# Altium schematic sheet STM32_SBM_v2.SchDoc
size A1
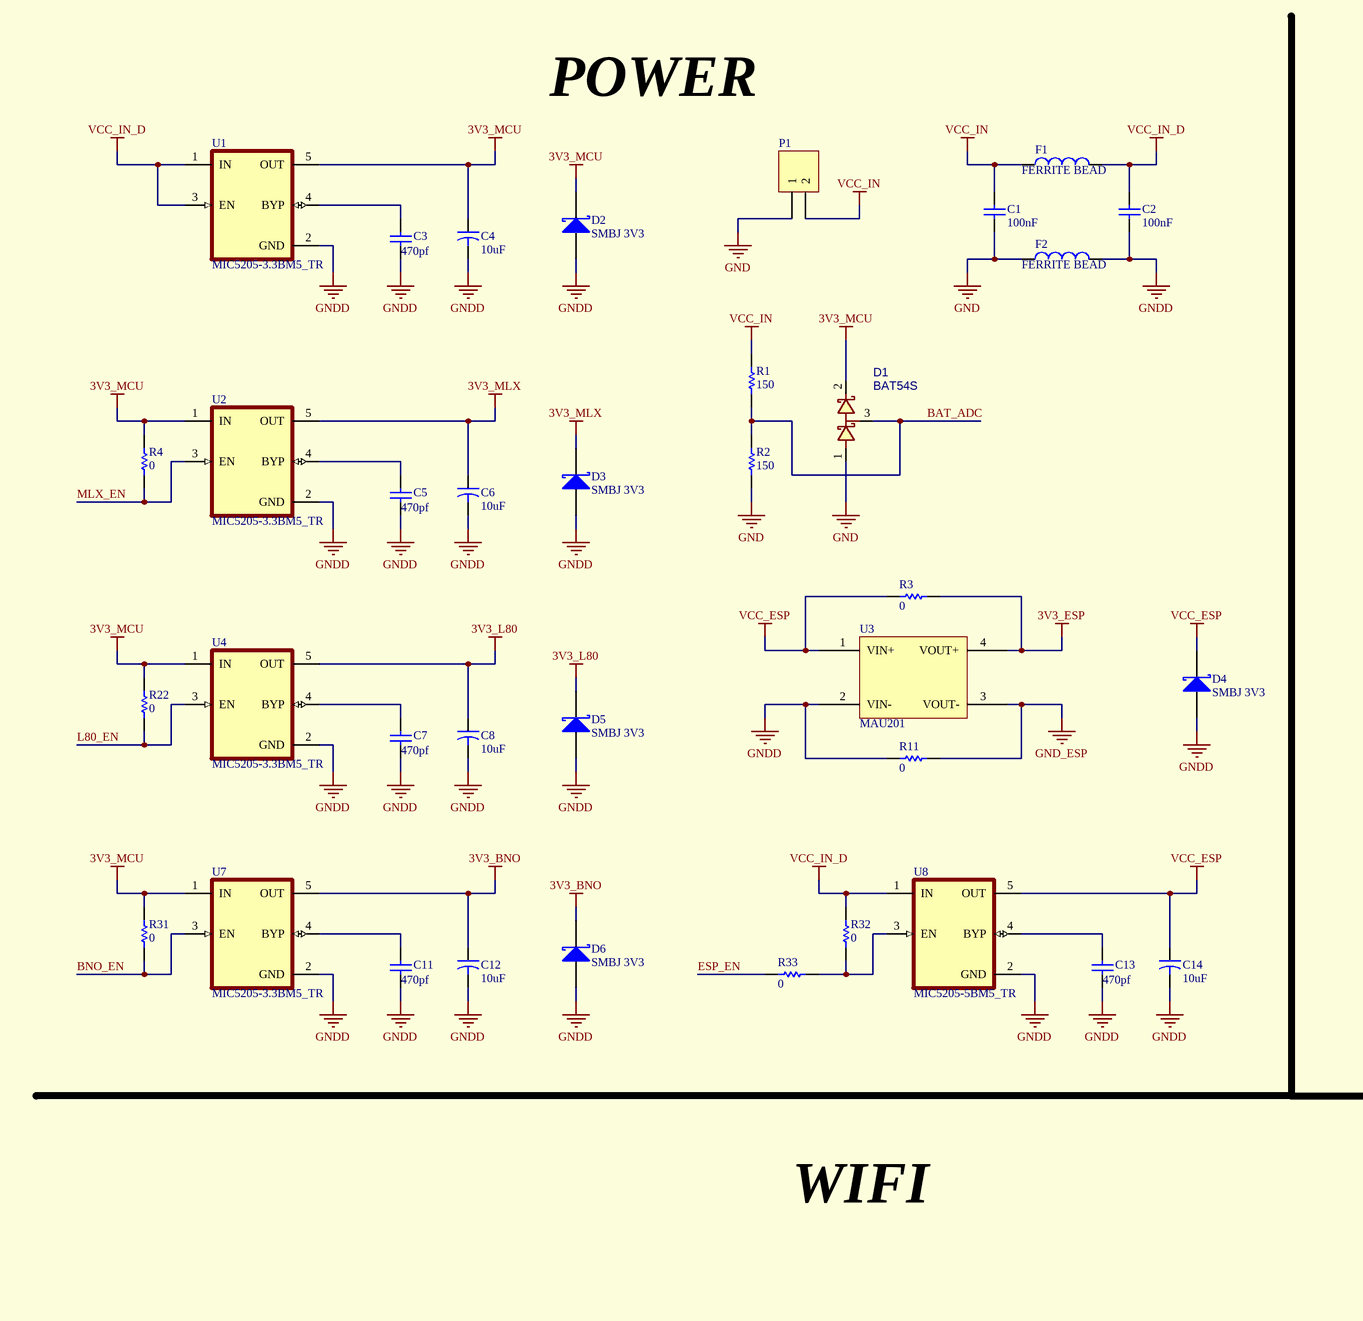
[diagram p0: STM32_SBM_v2.SchDoc, top left]
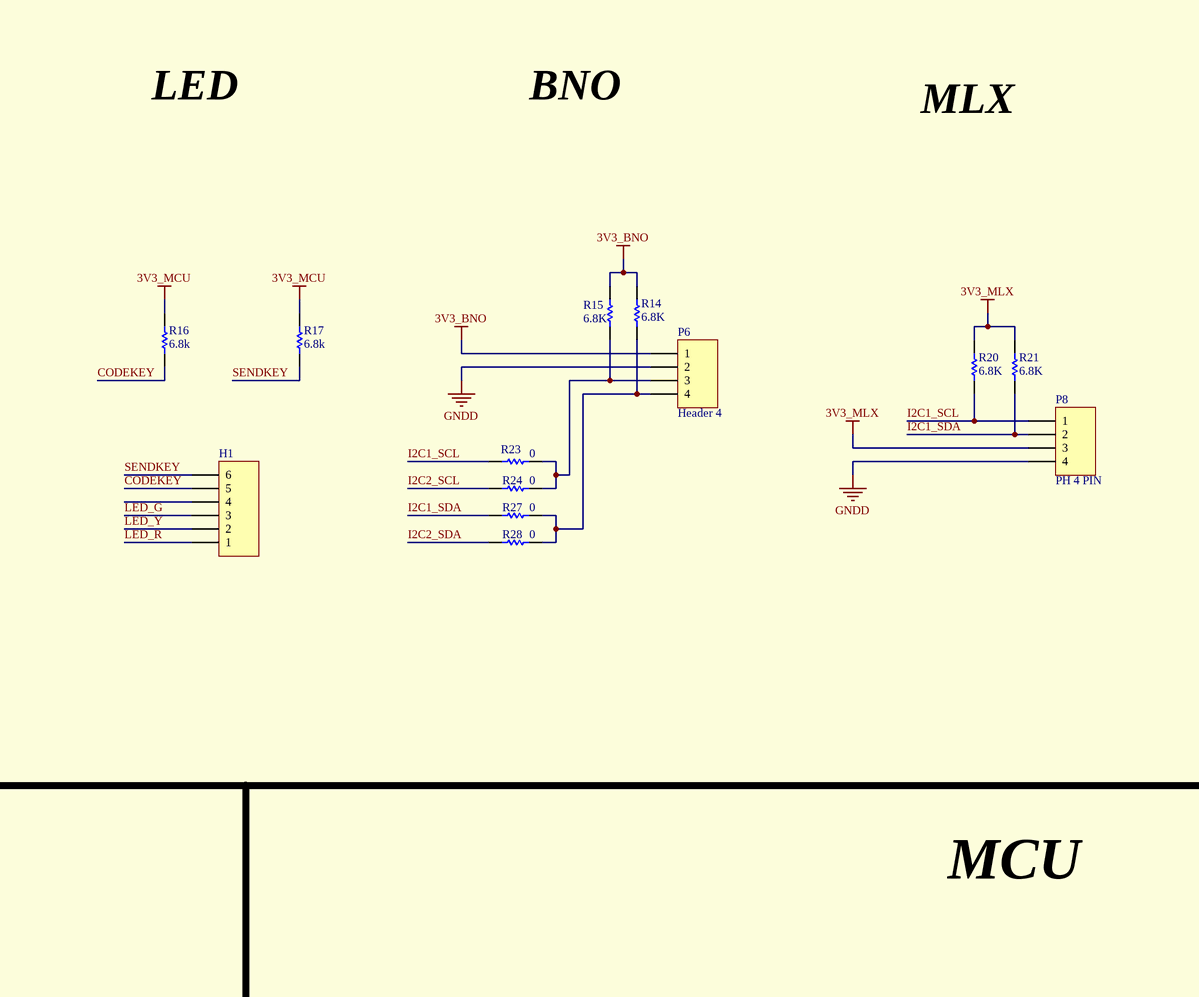
[diagram p1: STM32_SBM_v2.SchDoc, top middle]
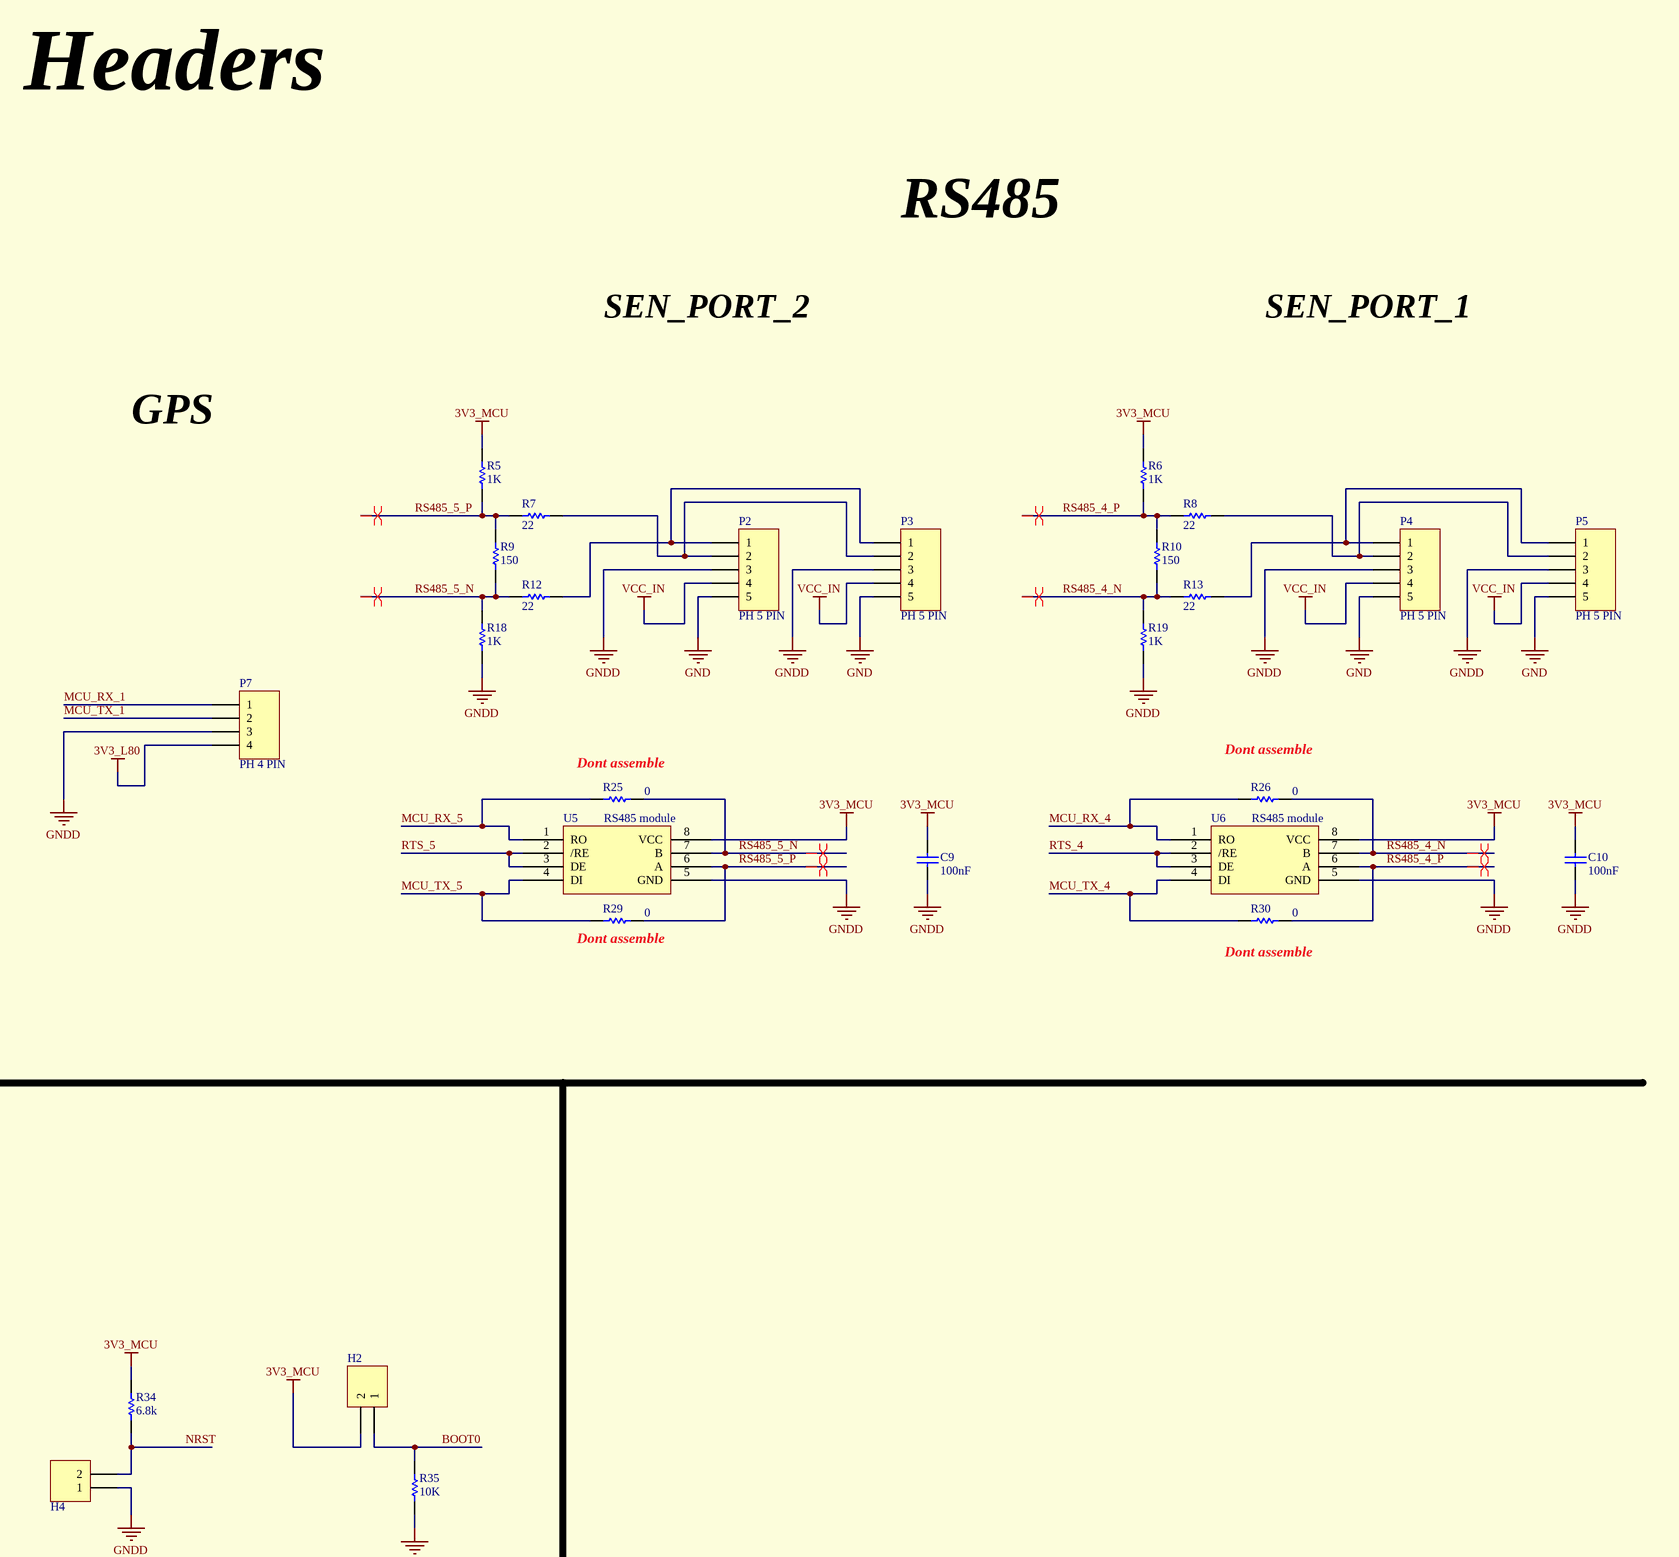
[diagram p2: STM32_SBM_v2.SchDoc, top right]
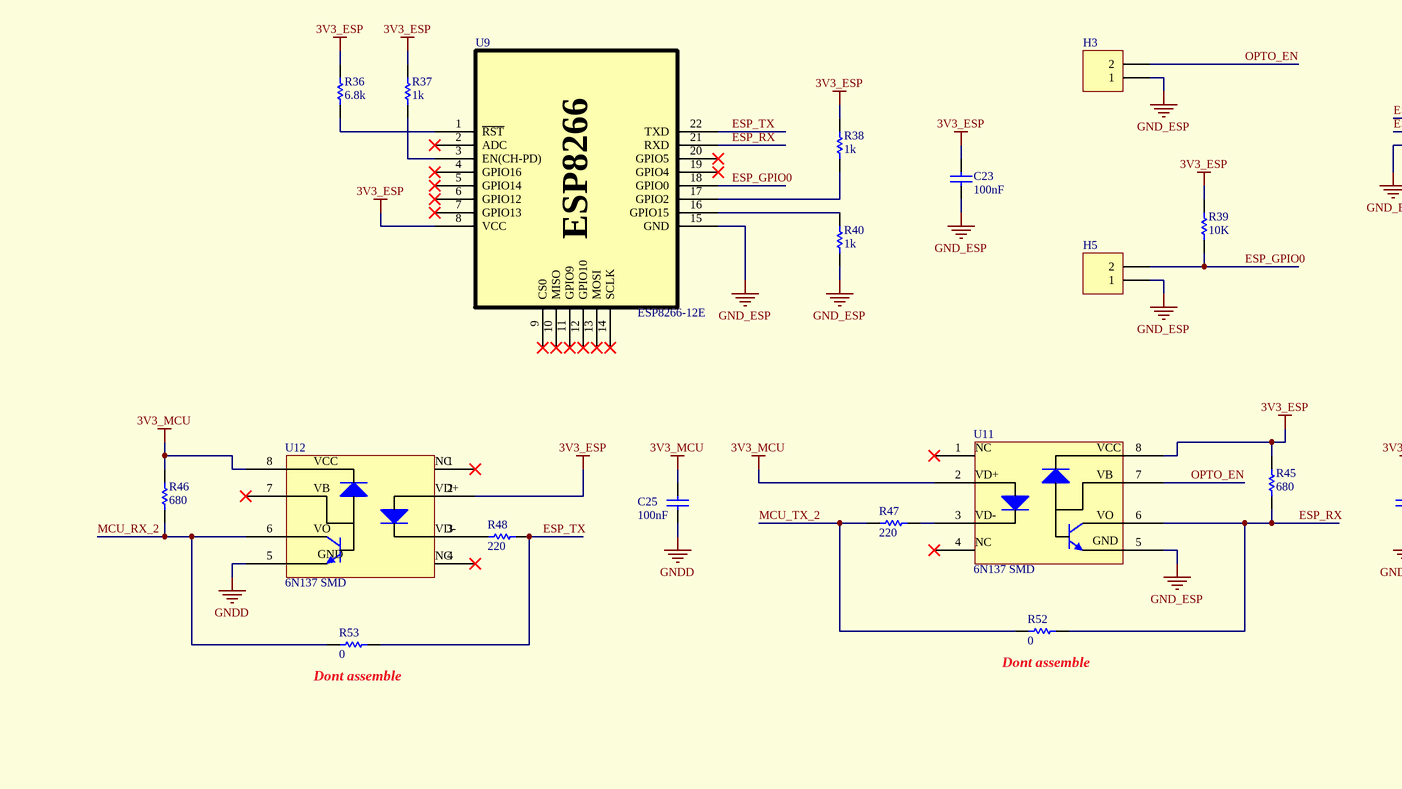
[diagram p3: STM32_SBM_v2.SchDoc, bottom left]
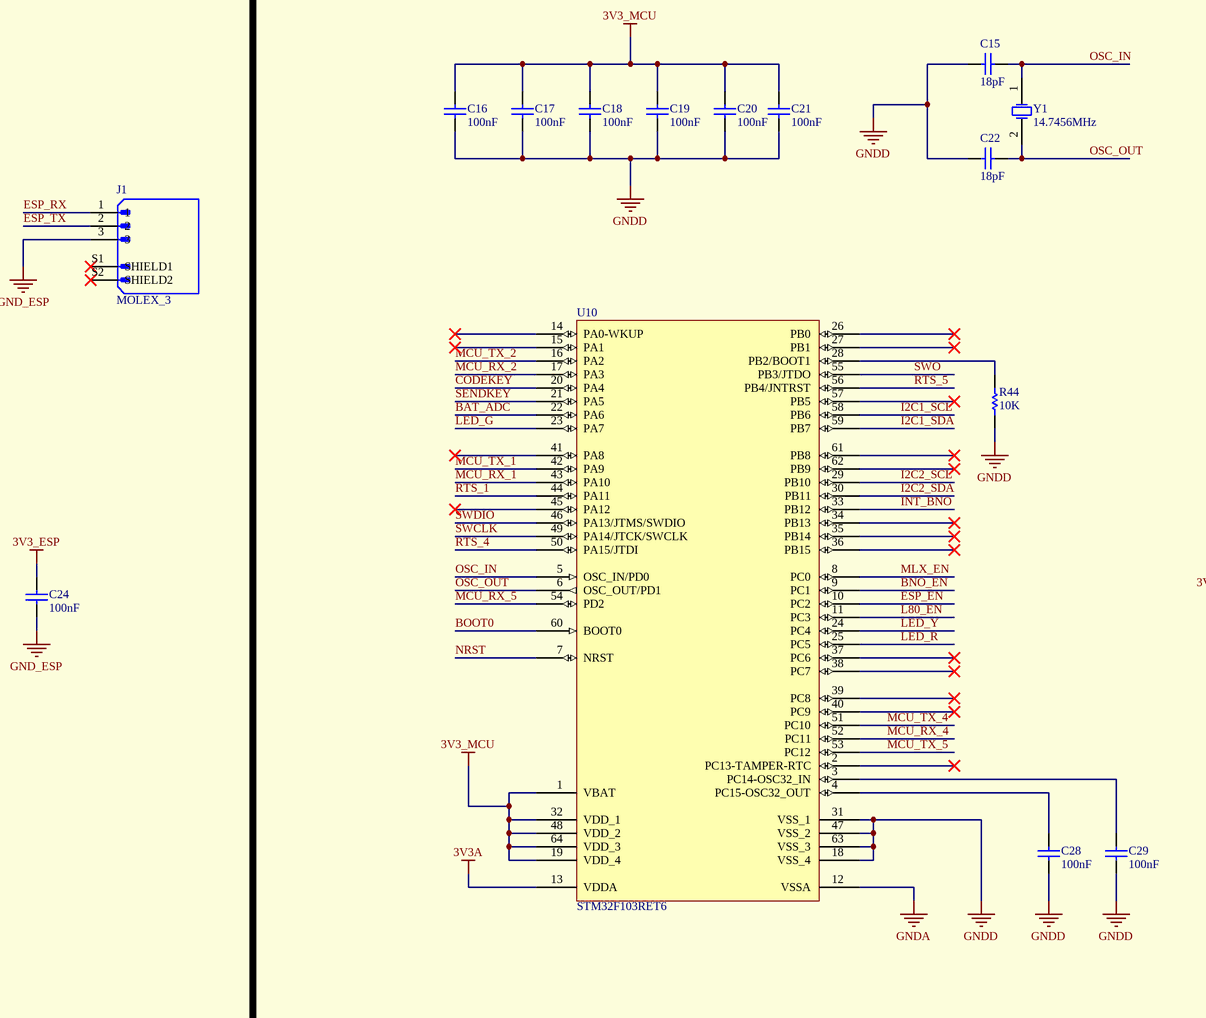
[diagram p4: STM32_SBM_v2.SchDoc, bottom middle]
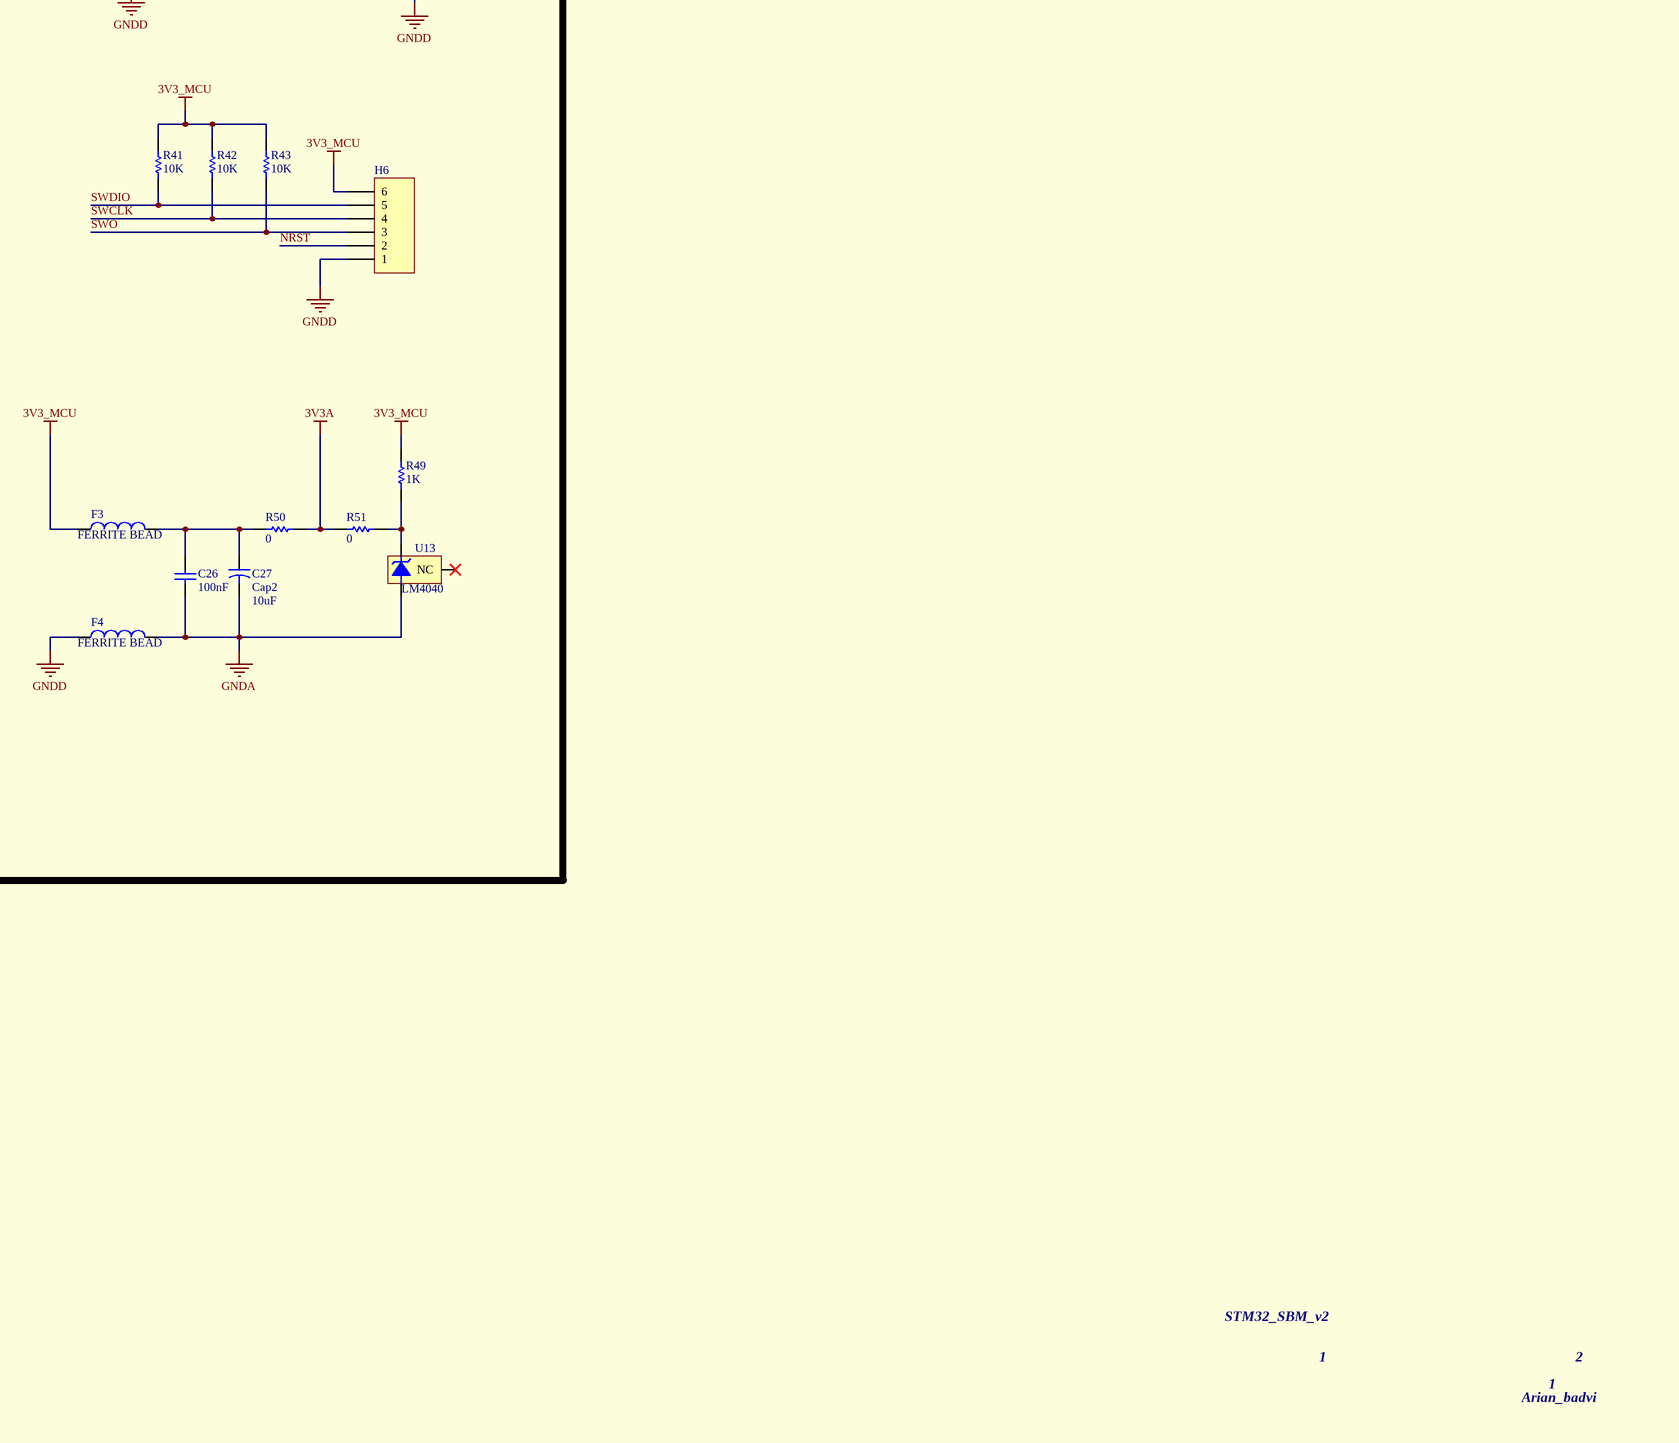
[diagram p5: STM32_SBM_v2.SchDoc, bottom right]

## Parts
C1  100nF  [C0805]
C2  100nF  [C0805]
C3  470pf  [C0805]
C4  10uF  [CAP_SMD_A]
C5  470pf  [C0805]
C6  10uF  [CAP_SMD_A]
C7  470pf  [C0805]
C8  10uF  [CAP_SMD_A]
C9  100nF  [C0805]
C10  100nF  [C0805]
C11  470pf  [C0805]
C12  10uF  [CAP_SMD_A]
C13  470pf  [C0805]
C14  10uF  [CAP_SMD_A]
C15  18pF  [C0805]
C16  100nF  [C0805]
C17  100nF  [C0805]
C18  100nF  [C0805]
C19  100nF  [C0805]
C20  100nF  [C0805]
C21  100nF  [C0805]
C22  18pF  [C0805]
C23  100nF  [C0805]
C24  100nF  [C0805]
C25  100nF  [C0805]
C26  value 100nF  [SMD_805]  (hidden comment: Cap)
C27  Cap2  value 10uF  [C_TN_3528]
C28  100nF  [C0805]
C29  100nF  [C0805]
D1  BAT54S  [SOT23_3]
D2  SMBJ 3V3  [TVS]
D3  SMBJ 3V3  [TVS]
D4  SMBJ 3V3  [TVS]
D5  SMBJ 3V3  [TVS]
D6  SMBJ 3V3  [TVS]
F1  FERRITE BEAD  [0805]
F2  FERRITE BEAD  [0805]
F3  FERRITE BEAD  [SMD_805]
F4  FERRITE BEAD  [SMD_805]
H1  PB 6pin SMD  [PB_6_SMD]  (value not drawn)
H2  Pin Header, 1.27  [H_1.27]  (value not drawn)
H3  Pin Header, 1.27  [H_1.27]  (value not drawn)
H4  Pin Header, 1.27  [H_1.27]  (value not drawn)
H5  Pin Header, 1.27  [H_1.27]  (value not drawn)
H6  PB 6pin SMD  [PB_6_SMD]  (value not drawn)
J1  MOLEX_3  [MOLEX_533980371]
P1  Header 2  [HDR1X2]  (value not drawn)
P2  PH 5 PIN  [PH_5]
P3  PH 5 PIN  [PH_5]
P4  PH 5 PIN  [PH_5]
P5  PH 5 PIN  [PH_5]
P6  Header 4  [HDR1X4]
P7  PH 4 PIN  [PH_4]
P8  PH 4 PIN  [PH_4]
R1  150  [0805]
R2  150  [0805]
R3  0
R4  0
R5  1K  [0805]
R6  1K  [0805]
R7  22  [0805]
R8  22  [0805]
R9  150  [0805]
R10  150  [0805]
R11  0
R12  22  [0805]
R13  22  [0805]
R14  6.8K  [0805]
R15  6.8K  [0805]
R16  6.8k  [0805]
R17  6.8k  [0805]
R18  1K  [0805]
R19  1K  [0805]
R20  6.8K  [0805]
R21  6.8K  [0805]
R22  0
R23  0
R24  0
R25  0  [0603]
R26  0  [0603]
R27  0
R28  0
R29  0  [0603]
R30  0  [0603]
R31  0
R32  0
R33  0
R34  6.8k  [0805]
R35  10K  [0805]
R36  6.8k  [0805]
R37  1k  [0805]
R38  1k  [0805]
R39  10K  [0805]
R40  1k  [0805]
R41  10K  [0805]
R42  10K  [0805]
R43  10K  [0805]
R44  10K  [0805]
R45  680  [0805]
R46  680  [0805]
R47  220  [0805]
R48  220  [0805]
R49  value 1K  [SMD_805]  (hidden comment: Res1)
R50  value 0  (hidden comment: Res1)
R51  value 0  (hidden comment: Res1)
R52  0  [0603]
R53  0  [0603]
U1  MIC5205-3.3BM5_TR  [SOT23_5]
U2  MIC5205-3.3BM5_TR  [SOT23_5]
U3  MAU201
U4  MIC5205-3.3BM5_TR  [SOT23_5]
U5  RS485 module  [SOP8]
U6  RS485 module  [SOP8]
U7  MIC5205-3.3BM5_TR  [SOT23_5]
U8  MIC5205-5BM5_TR  [SOT23_5]
U9  ESP8266-12E  [ESP8266_ESP12E]
U10  STM32F103RET6  [LQFP64]
U11  6N137 SMD  [DIP_8SMD]
U12  6N137 SMD  [DIP_8SMD]
U13  LM4040  [sot-23]
Y1  14.7456MHz  [XTAL_SMD]

## Nets
3V3_BNO: C12.1 D6.1(K) P6.1 R14.2 R15.2 U7.5(OUT)
3V3_ESP: C23.2 C24.2 R3.2 R36.1 R37.2 R38.2 R39.2 R45.2 U3.4(VOUT+) U9.8(VCC) U11.8 U12.2
3V3_L80: C8.1 D5.1(K) P7.4 U4.5(OUT)
3V3_MCU: C4.1 C9.2 C10.2 C16.2 C17.2 C18.2 C19.2 C20.2 C21.2 C25.2 D1.2 D2.1(K) F3.1 H2.2 H6.6 R4.1 R5.2 R6.2 R16.1 R17.1 R22.1 R31.1 R34.1 R41.1 R42.1 R43.1 R46.1 R49.1 U1.5(OUT) U2.1(IN) U4.1(IN) U5.8(VCC) U6.8(VCC) U7.1(IN) U10.1(VBAT) U10.19(VDD_4) U10.32(VDD_1) U10.48(VDD_2) U10.64(VDD_3) U11.2 U12.8
3V3_MLX: C6.1 D3.1(K) P8.3 R20.2 R21.2 U2.5(OUT)
3V3A: R50.1 R51.2 U10.13(VDDA)
GND: C1.1 D1.1 F2.1 P1.1 P2.5 P3.5 P4.5 P5.5 R2.2
GND_ESP: C23.1 C24.1 H3.1 H5.1 J1.3 R11.2 R40.2 U3.3(VOUT-) U9.15(GND) U11.5(GND)
GNDA: C26.1 C27.2 F4.2 U10.12(VSSA) U13.2(-V)
GNDD: C2.1 C3.1 C4.2 C5.1 C6.2 C7.1 C8.2 C9.1 C10.1 C11.1 C12.2 C13.1 C14.2 C15.1 C16.1 C17.1 C18.1 C19.1 C20.1 C21.1 C22.1 C25.1 C28.1 C29.1 D2.2(A) D3.2(A) D4.2(A) D5.2(A) D6.2(A) F2.2 F4.1 H4.1 H6.1 P2.3 P3.3 P4.3 P5.3 P6.2 P7.3 P8.4 R11.1 R18.1 R19.1 R35.2 R44.2 U1.2(GND) U2.2(GND) U3.2(VIN-) U4.2(GND) U5.5(GND) U6.5(GND) U7.2(GND) U8.2(GND) U10.18(VSS_4) U10.31(VSS_1) U10.47(VSS_2) U10.63(VSS_3) U12.5(GND)
VCC_ESP: C14.1 D4.1(K) R3.1 U3.1(VIN+) U8.5(OUT)
VCC_IN: C1.2 F1.1 P1.2 P2.4 P3.4 P4.4 P5.4 R1.1
VCC_IN_D: C2.2 F1.2 R32.1 U1.1(IN) U1.3(EN) U8.1(IN)
BAT_ADC: D1.3 R1.2 R2.1 U10.22(PA6)
BNO_EN: R31.2 U7.3(EN) U10.9(PC1)
BOOT0: H2.1 R35.1 U10.60(BOOT0)
CODEKEY: H1.5 R16.2 U10.20(PA4)
ESP_EN: R33.1 U10.10(PC2)
ESP_GPIO0: H5.2 R39.1 U9.18(GPIO0)
ESP_RX: J1.1 R45.1 R52.2 U9.21(RXD) U11.6
ESP_TX: J1.2 R48.2 R53.2 U9.22(TXD)
I2C1_SCL: P8.1 R20.1 R23.1 U10.58(PB6)
I2C1_SDA: P8.2 R21.1 R27.1 U10.59(PB7)
I2C2_SCL: R24.1 U10.29(PB10)
I2C2_SDA: R28.1 U10.30(PB11)
INT_BNO: U10.33(PB12)
L80_EN: R22.2 U4.3(EN) U10.11(PC3)
LED_G: H1.3 U10.23(PA7)
LED_R: H1.1 U10.25(PC5)
LED_Y: H1.2 U10.24(PC4)
MCU_RX_1: P7.1 U10.43(PA10)
MCU_RX_2: R46.2 R53.1 U10.17(PA3) U12.6
MCU_RX_4: R26.1 U6.1(RO) U10.52(PC11)
MCU_RX_5: R25.1 U5.1(RO) U10.54(PD2)
MCU_TX_1: P7.2 U10.42(PA9)
MCU_TX_2: R47.1 R52.1 U10.16(PA2)
MCU_TX_4: R30.1 U6.4(DI) U10.51(PC10)
MCU_TX_5: R29.1 U5.4(DI) U10.53(PC12)
MLX_EN: R4.2 U2.3(EN) U10.8(PC0)
NRST: H4.2 H6.2 R34.2 U10.7(NRST)
OPTO_EN: H3.2 U11.7
OSC_IN: C15.2 U10.5(OSC_IN/PD0) Y1.1(OSC1)
OSC_OUT: C22.2 U10.6(OSC_OUT/PD1) Y1.2(OSC2)
RS485_4_N: R10.2 R13.1 R19.2 R26.2 U6.7(B)
RS485_4_P: R6.1 R8.1 R10.1 R30.2 U6.6(A)
RS485_5_N: R9.2 R12.1 R18.2 R25.2 U5.7(B)
RS485_5_P: R5.1 R7.1 R9.1 R29.2 U5.6(A)
RTS_1: U10.44(PA11)
RTS_4: U6.2(/RE) U6.3(DE) U10.50(PA15/JTDI)
RTS_5: U5.2(/RE) U5.3(DE) U10.56(PB4/JNTRST)
SENDKEY: H1.6 R17.2 U10.21(PA5)
SWCLK: H6.4 R42.2 U10.49(PA14/JTCK/SWCLK)
SWDIO: H6.5 R41.2 U10.46(PA13/JTMS/SWDIO)
SWO: H6.3 R43.2 U10.55(PB3/JTDO)
NetC3_2: C3.2 U1.4(BYP)
NetC5_2: C5.2 U2.4(BYP)
NetC7_2: C7.2 U4.4(BYP)
NetC11_2: C11.2 U7.4(BYP)
NetC13_2: C13.2 U8.4(BYP)
NetC26_2: C26.2 C27.1 F3.2 R50.2
NetC28_2: C28.2 U10.4(PC15-OSC32_OUT)
NetC29_2: C29.2 U10.3(PC14-OSC32_IN)
NetP2_1: P2.1 P3.1 R12.2
NetP2_2: P2.2 P3.2 R7.2
NetP4_1: P4.1 P5.1 R13.2
NetP4_2: P4.2 P5.2 R8.2
NetP6_3: P6.3 R15.1 R23.2 R24.2
NetP6_4: P6.4 R14.1 R27.2 R28.2
NetR32_2: R32.2 R33.2 U8.3(EN)
NetR36_2: R36.2 U9.1(~{RST})
NetR37_1: R37.1 U9.3(EN(CH-PD))
NetR38_1: R38.1 U9.17(GPIO2)
NetR40_1: R40.1 U9.16(GPIO15)
NetR44_1: R44.1 U10.28(PB2/BOOT1)
NetR47_2: R47.2 U11.3
NetR48_1: R48.1 U12.3
NetR49_2: R49.2 R51.1 U13.1(+V)

Not connected (* = marked no-connect by the designer): H1 4; J1 S1(SHIELD1)* S2(SHIELD2)*; U9 2(ADC)* 4(GPIO16)* 5(GPIO14)* 6(GPIO12)* 7(GPIO13)* 9(CS0)* 10(MISO)* 11(GPIO9)* 12(GPIO10)* 13(MOSI)* 14(SCLK)* 19(GPIO4)* 20(GPIO5)*; U10 2(PC13-TAMPER-RTC)* 14(PA0-WKUP)* 15(PA1)* 26(PB0)* 27(PB1)* 34(PB13)* 35(PB14)* 36(PB15)* 37(PC6)* 38(PC7)* 39(PC8)* 40(PC9)* 41(PA8)* 45(PA12)* 57(PB5)* 61(PB8)* 62(PB9)*; U11 1* 4*; U12 1* 4* 7*; U13 3(NC)*

## Layout directives
differential pair: RS485_4_N, RS485_4_P, RS485_5_N, RS485_5_P

## Notes on the sheet
- POWER
- Headers
- RS485
- SEN_PORT_2
- SEN_PORT_1
- LED
- BNO
- MLX
- GPS
- (near R25) Dont assemble
- (near R26) Dont assemble
- (near R29) Dont assemble
- (near R30) Dont assemble
- WIFI
- MCU
- (near R52) Dont assemble
- (near R53) Dont assemble
- STM32_SBM_v2
- 1
- Arian_badvi
- 2
- (in symbol 6N137) VCC; NC; VB; VD+; VO; VD-

## Library data of the parts
C1 C2 C9 C10 C15-C24 C26 C28 C29 = Cap: Capacitor; Published: 8-Jun-2000; LatestRevisionDate: 17-Jul-2002; LatestRevisionNote: Re-released for DXP Platform.; PackageReference: RAD-0.3; Publisher: Altium Limited
  C1 C2 C9 C10 C16-C21 C23 C24 C28 C29: Value: 100nF
  C15 C22: Value: 18pF
C3 C5 C7 C11 C13 C25 = Cap: Capacitor, 1206; Published: 8-Jun-2000; LatestRevisionDate: 17-Jul-2002; LatestRevisionNote: Re-released for DXP Platform.; PackageReference: RAD-0.3; Publisher: Altium Limited
  C3 C5 C7 C11 C13: PackageDescription: Radial Cap, Thru-Hole; 2 Leads; 0.3 in Pin Spacing; Value: 470pf
  C25: Value: 100nF
C4 C6 C8 C12 C14 C27 = Cap2: Capacitor, 10uf; Published: 23-Sep-2002; PackageReference: CAPR5-4X5; Publisher: Altium Limited
  C4 C6 C8 C12 C14: Value: 10uF
D1 = DIODE_SMD_SCHOTTKY_BAT54S: DIODE, SCHOTTKY, DUAL, 30V, 0.2A; MANF: Diodes, NXP; MANF_P#: BAT54SW; DESC: DESCRIPTION; PARAM: 30V/200MW; ASSEMBLY: ASSEMBLY; PRICE: 0.2$; PARAM2: 0.2A; VALUE: BAT54S
D2-D6 = Diode 18TQ045: TVS; Note: Terminal 2 is the TAB and is electrically connected to the cathode; Published: 8-Jun-2000; LatestRevisionDate: 17-Jul-2002; LatestRevisionNote: Re-released for DXP Platform.; DatasheetVersion: Dec-1997; PackageVersion: Feb-1998; PackageReference: TO-220AC; Publisher: Altium Limited; ComponentLink1Description: Manufacturer Link; ComponentLink1URL: http://www.irf.com/; ComponentLink2Description: Datasheet; ComponentLink2URL: http://www.irf.com/product-info/datasheets/data/18tq.pdf
F1-F4 = Inductor: Code_IEC: 1005; Published: 8-Jun-2000; LatestRevisionDate: 29-May-2009; LatestRevisionNote: IPC-7351 Footprint Added.; PackageReference: 0402-A; Publisher: Altium Limited; PackageDescription: Chip Inductor; Code_JEITA: 0402
H1 H6 = Header 6: White SMD Connector 6pin; LatestRevisionDate: 17-Jul-2002; LatestRevisionNote: Re-released for DXP Platform.; Publisher: Altium Limited
H2-H5 = Header 2: Header, 2-Pin, 1.27mm; LatestRevisionDate: 17-Jul-2002; LatestRevisionNote: Re-released for DXP Platform.; Publisher: Altium Limited
J1 = MOLEX_3: Connector Header Surface Mount 3 position 0.049 (1.25mm); MP: 533980371; MF: Molex; Purchase-URL: https://pricing.snapeda.com/search/part/533980371/?ref=eda; Package: None; Value: *; SnapEDA_Link: https://www.snapeda.com/parts/533980371/Molex/view-part/4544516/?ref=snap; Availability: In Stock; Price: None; Check_prices: https://www.snapeda.com/parts/533980371/Molex/view-part/4544516/?ref=eda
P1 = Header 2: Header, 2-Pin; LatestRevisionDate: 17-Jul-2002; LatestRevisionNote: Re-released for DXP Platform.; Publisher: Altium Limited
P2-P5 = Header 5: Header, 5-Pin; LatestRevisionDate: 17-Jul-2002; LatestRevisionNote: Re-released for DXP Platform.; Publisher: Altium Limited
P6-P8 = Header 4: Header, 4-Pin; LatestRevisionDate: 17-Jul-2002; LatestRevisionNote: Re-released for DXP Platform.; Publisher: Altium Limited
R1 R2 R5-R10 R12-R15 R18-R21 R37-R40 = Res1: Resistor; Published: 8-Jun-2000; LatestRevisionDate: 17-Jul-2002; LatestRevisionNote: Re-released for DXP Platform.; PackageReference: AXIAL-0.3; Publisher: Altium Limited
  R1 R2 R9 R10: Value: 150
  R5 R6 R18 R19: Value: 1K
  R7 R8 R12 R13: Value: 22
  R14 R15 R20 R21: Value: 6.8K
  R37 R38 R40: Value: 1k
  R39: Value: 10K
R3 R4 R11 R22-R24 R27 R28 R31-R33 R45 R47 R48 R52 R53 = Resistor: General Resistor; Published: 8-Jun-2000; LatestRevisionDate: 17-Jul-2002; LatestRevisionNote: Re-released for DXP Platform.; PackageReference: AXIAL-0.3; Publisher: Altium Limited; PackageDescription: Axial Device, Thru-Hole; 2 Leads; 0.3 in Pin Spacing
  R3 R4 R11 R22-R24 R27 R28 R31-R33 R52 R53: Value: 0
  R45: Value: 680
  R47 R48: Value: 220
R16 R17 R34 R36 R46 = Res1: Resistor, 6.8k; Published: 8-Jun-2000; LatestRevisionDate: 17-Jul-2002; LatestRevisionNote: Re-released for DXP Platform.; PackageReference: AXIAL-0.3; Publisher: Altium Limited
  R16 R17 R34 R36: Value: 6.8k
  R46: Value: 680
R25 R26 R29 R30 R41-R43 R49-R51 = Res1: Resistor, 10K; Published: 8-Jun-2000; LatestRevisionDate: 17-Jul-2002; LatestRevisionNote: Re-released for DXP Platform.; PackageReference: AXIAL-0.3; Publisher: Altium Limited
  R25 R26 R29 R30: Value: 0
  R41-R43: Value: 10K
R35 R44 = Res1: Resistor, 10k; Published: 8-Jun-2000; LatestRevisionDate: 17-Jul-2002; LatestRevisionNote: Re-released for DXP Platform.; PackageReference: AXIAL-0.3; Publisher: Altium Limited; Value: 10K
U1 U2 U4 U7 U8 = MIC5205-3.3BM5_TR: Linear Voltage Regulator IC 1 Output 150mA SOT-23-5; MP: MIC5205-3.3BM5 TR; MF: Micrel; Package: SOT-23-5 Micrel; Value: *; Availability: Unavailable; Price: None; SnapEDA_Link: https://www.snapeda.com/parts/MIC5205-3.3BM5%20TR/Micrel/view-part/225112/?ref=snap
U3 = MAU201: High isolation,single output DC/DC converter,3.3output,5 input
U5 U6 = rs485
U9 = ESP8266
U10 = STM32F103R8T6: STM32 ARM-based 32-bit MCU with 64 Kbytes Flash, 64-pin LQFP, Industrial Temperature; Published: 30-May-2008; DatasheetVersion: rev6, Mar-2008; PackageVersion: Mar-2008; PackageReference: LQFP64; Publisher: Altium Limited; PackageDescription: 64-Pin Low-Profile Quad Flat Pack, 10 x 10 mm Body, 0.5 mm Pitch (LQFP64); ComponentLink1Description: Manufacturer Link; ComponentLink1URL: www.st.com/stm32; ComponentLink2Description: Datasheet; ComponentLink2URL: http://www.st.com/stonline/products/literature/ds/13587.pdf
U11 U12 = 6N137
U13 = LM4040: Precision Micropower Shunt Voltage Reference, 3-pin SOT-23; PartNumber: LM4040DIM3-10.0; Manufacturer: National Semiconductor; PackageTopMarking: R0D*XTT; PowerWise: N; CompType: Voltage Reference IC; Published: 4-Dec-2008; DatasheetVersion: Apr-2005; PackageVersion: revB, Mar-2003; PackageReference: MF03A; Publisher: Altium Limited; PackageDescription: Molded SOT-23, .115 x .051 x .037in Body, 3 Lead, .075 in Pitch; RoHS: N; PinCount: 3; ComponentLink1Description: LM4040 Datasheet; ComponentLink1URL: http://www.national.com/ds/LM/LM4040.pdf; ComponentLink2Description: LM4040 Web Page; ComponentLink2URL: http://www.national.com/pf/LM/LM4040.html; ComponentLink3Description: MF03A Package Page; ComponentLink3URL: http://www.national.com/packaging/folders/mf03a.html
Y1 = XTAL: Crystal Oscillator, 14.7456KHz; Published: 8-Jun-2000; LatestRevisionDate: 17-Jul-2002; LatestRevisionNote: Re-released for DXP Platform.; PackageReference: R38; Publisher: Altium Limited